# EAGLE design LVBarGraphDriver (EAGLE 7.5.0)
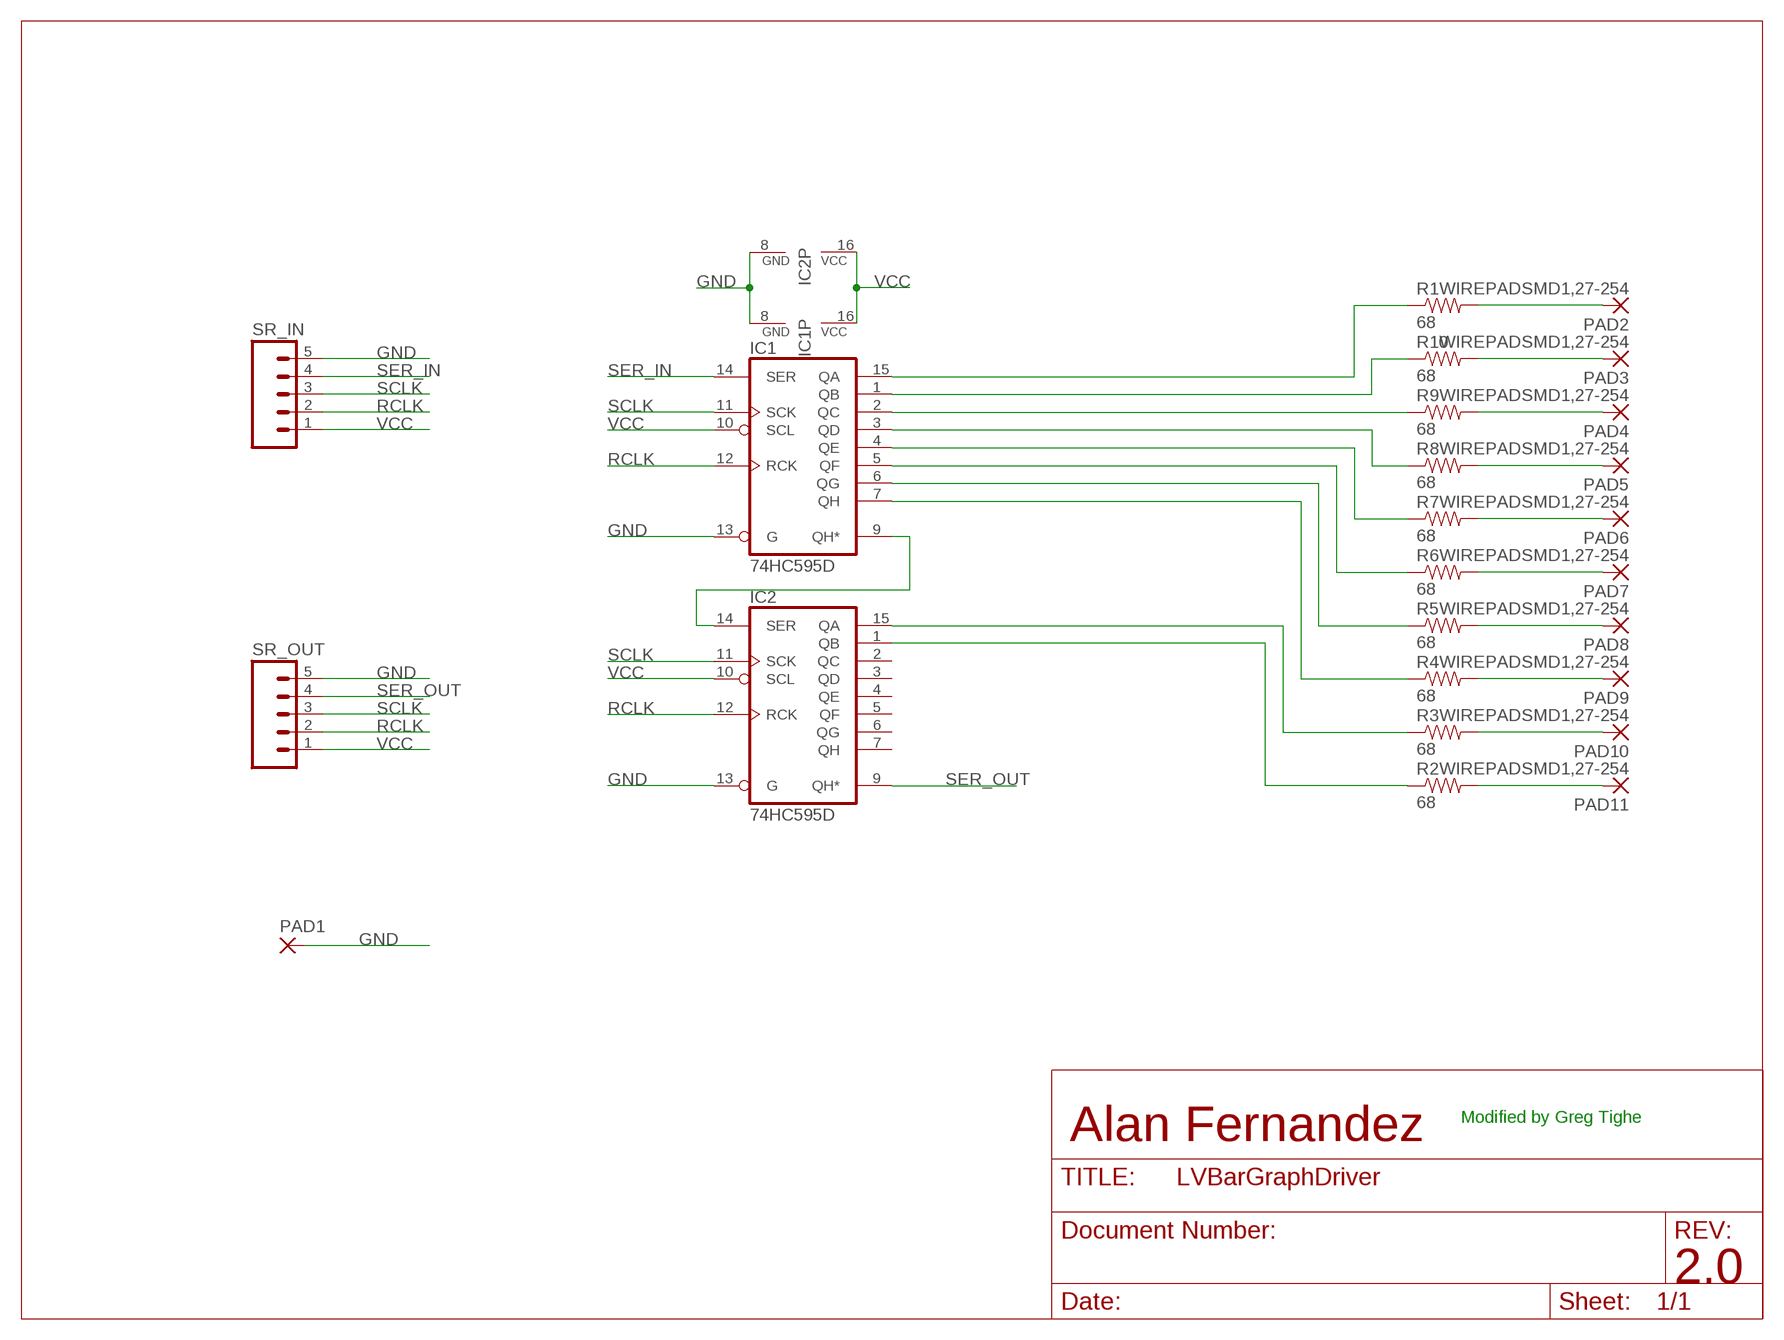
[diagram p0: schematic, sheet 1]

## Parts
IC1  74HC595D  [SO16]
IC2  74HC595D  [SO16]
PAD1  SMD2  [SMD1,27-2,54]
PAD2  WIREPADSMD1,27-254  [SMD1,27-2,54]
PAD3  WIREPADSMD1,27-254  [SMD1,27-2,54]
PAD4  WIREPADSMD1,27-254  [SMD1,27-2,54]
PAD5  WIREPADSMD1,27-254  [SMD1,27-2,54]
PAD6  WIREPADSMD1,27-254  [SMD1,27-2,54]
PAD7  WIREPADSMD1,27-254  [SMD1,27-2,54]
PAD8  WIREPADSMD1,27-254  [SMD1,27-2,54]
PAD9  WIREPADSMD1,27-254  [SMD1,27-2,54]
PAD10  WIREPADSMD1,27-254  [SMD1,27-2,54]
PAD11  WIREPADSMD1,27-254  [SMD1,27-2,54]
R1  68  RESISTOR1206  [1206]
R2  68  RESISTOR1206  [1206]
R3  68  RESISTOR1206  [1206]
R4  68  RESISTOR1206  [1206]
R5  68  RESISTOR1206  [1206]
R6  68  RESISTOR1206  [1206]
R7  68  RESISTOR1206  [1206]
R8  68  RESISTOR1206  [1206]
R9  68  RESISTOR1206  [1206]
R10  68  RESISTOR1206  [1206]
SR_IN  M05PTH  [1X05]
SR_OUT  M05PTH  [1X05]

## Nets
GND [GND]: IC1.8(GND) IC1.13(G) IC2.8(GND) IC2.13(G) PAD1.1(P) SR_IN.5 SR_OUT.5
N$1 [LED]: PAD11.1(P) R2.2
N$2 [LED]: PAD10.1(P) R3.2
N$3 [LED]: PAD9.1(P) R4.2
N$4 [LED]: PAD8.1(P) R5.2
N$5 [LED]: PAD7.1(P) R6.2
N$6 [LED]: PAD6.1(P) R7.2
N$7 [LED]: PAD5.1(P) R8.2
N$8 [LED]: PAD4.1(P) R9.2
N$9 [LED]: PAD3.1(P) R10.2
N$10 [LED]: PAD2.1(P) R1.2
N$11 [LED]: IC1.15(QA) R1.1
N$12 [LED]: IC1.1(QB) R10.1
N$13 [LED]: IC1.2(QC) R9.1
N$14 [LED]: IC1.3(QD) R8.1
N$15 [LED]: IC1.4(QE) R7.1
N$16 [LED]: IC1.5(QF) R6.1
N$17 [LED]: IC1.6(QG) R5.1
N$18 [LED]: IC1.7(QH) R4.1
N$19 [LED]: IC2.15(QA) R3.1
N$20 [LED]: IC2.1(QB) R2.1
N$22: IC1.9(QH*) IC2.14(SER)
RCLK: IC1.12(RCK) IC2.12(RCK) SR_IN.2 SR_OUT.2
SCLK: IC1.11(SCK) IC2.11(SCK) SR_IN.3 SR_OUT.3
SER_IN: IC1.14(SER) SR_IN.4
SER_OUT: IC2.9(QH*) SR_OUT.4
VCC [VCC]: IC1.10(SCL) IC1.16(VCC) IC2.10(SCL) IC2.16(VCC) SR_IN.1 SR_OUT.1
Unconnected: IC2.2(QC) IC2.3(QD) IC2.4(QE) IC2.5(QF) IC2.6(QG) IC2.7(QH)

## Notes on the sheet
- Modified by Greg Tighe
- Alan Fernandez
- 2.0

## Library data of the parts
IC1 IC2 = 74xx-eu:74*595: 8-bit SHIFT REGISTER, output latch
PAD1 = wirepad:SMD2: SMD PAD
PAD2-PAD11 = wirepad:WIREPAD: Wire PAD connect wire on PCB
R1-R10 = SparkFun-Resistors:RESISTOR: Resistor Basic schematic elements and footprints for 0603, 1206, and PTH resistors.
SR_IN SR_OUT = SparkFun-Connectors:M05: Header 5 Standard 5-pin 0.1" header. Use with straight break away headers (SKU : PRT-00116), right angle break away headers (PRT-00553), swiss pins (PRT-00743), machine pins (PRT-00117), and female headers (PRT-00115). Molex polarized connector foot print use with SKU : PRT-08230 with associated crimp pins and housings.

## Net classes
0 default: width 0.406 mm, drill 0.381 mm, clearance 0.305 mm
1 VCC: width 0.406 mm, drill 0.381 mm, clearance 0.305 mm
2 LED: width 0.406 mm, drill 0.381 mm, clearance 0.305 mm
3 GND: width 0.406 mm, drill 0.381 mm, clearance 0.305 mm

## Board
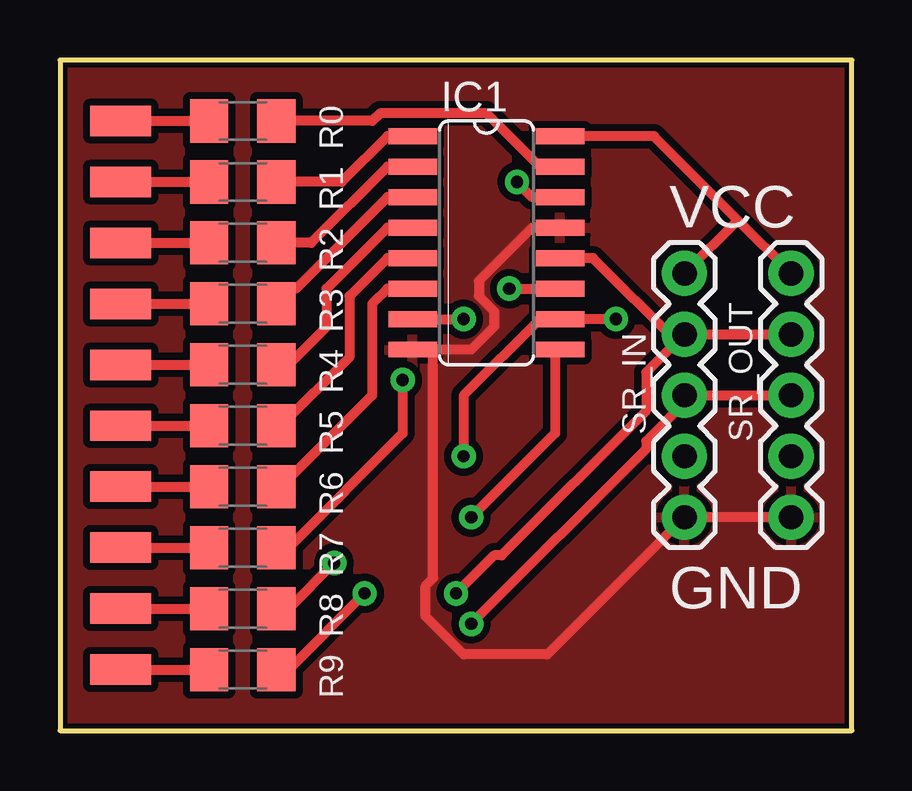
[diagram p1: board, top side]
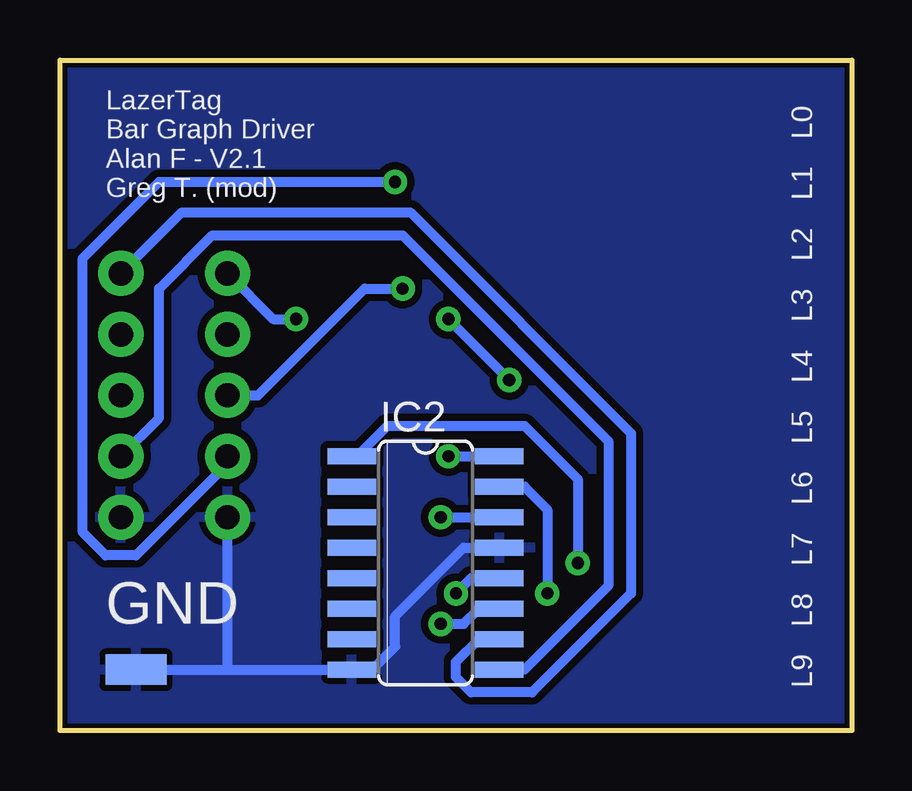
[diagram p2: board, bottom side, seen from below]

Size 33.02 x 27.94 mm. Coordinates in mm from the lower left corner, seen from the top.
Outline: 0,27.94 0,0 33.02,0 33.02,27.94 0,27.94
Copper layers (1*16): Top 0.035mm / dielectric 1.5mm / Bottom 0.035mm
Design rules "SparkFun-2-layer-STANDARD": minimum track width 10mil, minimum drill 20mil, track to track 10mil, track to pad 8mil, pad to pad 8mil, via to via 10mil, smd to smd 8mil, copper to edge 8mil, drill to drill 8mil, minimum pad ring 10mil, minimum via ring 10mil, stop-mask expansion 4mil, vias tented up to drill 25mil, thermal gap 10mil

### Footprints (pad centres in the part's own frame; a part is rotated, then mirrored left to right if it is on the bottom)
SO16 = smd 0.66 x 2.032: 1 -4.445,-3.073; 2 -3.175,-3.073; 3 -1.905,-3.073; 4 -0.635,-3.073; 5 0.635,-3.073; 6 1.905,-3.073; 7 3.175,-3.073; 8 4.445,-3.073; 9 4.445,3.073; 10 3.175,3.073; 11 1.905,3.073; 12 0.635,3.073; 13 -0.635,3.073; 14 -1.905,3.073; 15 -3.175,3.073; 16 -4.445,3.073
SMD1,27-2,54 = smd 1.27 x 2.54: 1 0,0
1206 = smd 1.6 x 1.8: 1 -1.4,0; 2 1.4,0
1X05 = drill 1.016 pad 1.88: 1 0,0; 2 2.54,0; 3 5.08,0; 4 7.62,0; 5 10.16,0

### Placement (x,y rotation side)
IC1  17.78,20.32 270 top
IC2  17.78,6.98 270 bottom
PAD1  29.84,2.54 90 bottom
PAD2  2.54,25.4 90 top
PAD3  2.54,22.86 90 top
PAD4  2.54,20.32 90 top
PAD5  2.54,17.78 90 top
PAD6  2.54,15.24 90 top
PAD7  2.54,12.7 90 top
PAD8  2.54,10.16 90 top
PAD9  2.54,7.62 90 top
PAD10  2.54,2.54 90 top
PAD11  2.54,5.08 90 top
R1  7.62,25.4 180 top
R2  7.62,5.08 180 top
R3  7.62,2.54 180 top
R4  7.62,7.62 180 top
R5  7.62,10.16 180 top
R6  7.62,12.7 180 top
R7  7.62,15.24 180 top
R8  7.62,17.78 180 top
R9  7.62,20.32 180 top
R10  7.62,22.86 180 top
SR_IN  26.03,19.05 270 top
SR_OUT  30.48,19.05 270 top

### Tracks (layer width: path | path; a pad name or v marks a point on that pad's centre or on a via)
GND
  Top 0.406: 15.56,15.88 17.14,15.88 18.1,16.83 18.1,17.46 17.46,18.1 17.46,18.73 19.68,20.95 IC1.13 | SR_OUT.5 SR_IN.5 20.32,3.18 16.83,3.18 15.24,4.76 15.24,6.03 15.56,6.35 15.56,15.88 | 15.56,15.88 IC1.8
  Bottom 0.406: PAD1.1 26.03,2.54 | 26.03,2.54 IC2.8 20,2.54 19.05,3.49 19.05,4.76 16.19,7.62 IC2.13 | 26.03,2.54 SR_IN.5
  pour Top: 0,27.94 33.02,27.94 33.02,0 0,0
  pour Bottom: 0,27.94 33.02,27.94 33.02,0 0,0
N$1
  Top 0.406: PAD11.1 R2.2
N$2
  Top 0.406: PAD10.1 R3.2
N$3
  Top 0.406: PAD9.1 R4.2
N$4
  Top 0.406: PAD8.1 R5.2
N$5
  Top 0.406: PAD7.1 R6.2
N$6
  Top 0.406: PAD6.1 R7.2
N$7
  Top 0.406: PAD5.1 R8.2
N$8
  Top 0.406: PAD4.1 R9.2
N$9
  Top 0.406: PAD3.1 R10.2
N$10
  Top 0.406: PAD2.1 R1.2
N$11
  Top 0.406: R1.1 13.02,25.4 13.33,25.72 17.78,25.72 20,23.49 IC1.15
N$12
  Top 0.406: IC1.1 13.65,24.77 11.75,22.86 9.53,22.86 R10.1
N$13
  Top 0.406: IC1.2 13.65,23.49 10.48,20.32 9.53,20.32 R9.1
N$14
  Top 0.406: R8.1 9.53,17.78 9.53,18.41 9.84,18.41 13.65,22.23 IC1.3
N$15
  Top 0.406: IC1.4 13.65,20.95 11.11,18.41 11.11,16.83 9.53,15.24 R7.1
N$16
  Top 0.406: 8.89,12.06 8.89,12.57 R6.1 9.21,12.7 12.06,15.56 12.06,18.1 13.65,19.69 IC1.5
N$17
  Top 0.406: IC1.6 13.65,18.41 13.02,17.78 13.02,13.97 9.21,10.16 R5.1
N$18  (via drill 0.51)
  Top 0.406: v14.29,14.61 14.29,12.38 9.53,7.62 R4.1 | IC1.7 v16.83,17.15
  Bottom 0.406: v16.83,17.15 v14.29,14.61
N$19  (via drill 0.51)
  Top 0.406: v12.7,5.71 9.53,2.54 R3.1
  Bottom 0.406: v12.7,5.71 12.7,9.21 13.65,10.16 IC2.15
N$20  (via drill 0.51)
  Top 0.406: v11.43,6.98 9.53,5.08 R2.1
  Bottom 0.406: v11.43,6.98 11.43,10.48 13.65,12.7 19.37,12.7 20.64,11.43 IC2.1
N$22  (via drill 0.51)
  Top 0.406: v17.14,8.89 20.64,12.38 20.64,15.88 IC1.9
  Bottom 0.406: v17.14,8.89 IC2.14
RCLK  (via drill 0.51)
  Top 0.406: v16.51,5.71 18.1,7.3 18.41,7.3 24.45,13.34 24.45,14.92 25.72,16.19 | IC1.12 22.23,19.69 25.72,16.19 | 25.72,16.19 SR_IN.2 SR_OUT.2
  Bottom 0.406: IC2.12 15.87,6.35 v16.51,5.71
SCLK  (via drill 0.51)
  Top 0.406: v17.14,4.45 24.45,11.75 24.45,12.06 26.03,13.65 SR_IN.3 SR_OUT.3 | v18.73,18.41 IC1.11
  Bottom 0.406: IC2.11 15.56,5.08 16.19,4.45 v17.14,4.45 | v18.73,18.41 20.32,18.41 24.77,13.97 SR_IN.3
SER_IN  (via drill 0.51)
  Top 0.406: IC1.14 19.68,22.23 v19.05,22.86
  Bottom 0.406: v19.05,22.86 28.89,22.86 32.07,19.69 32.07,8.25 31.11,7.3 29.84,7.3 26.03,11.11 SR_IN.4
SER_OUT
  Bottom 0.406: IC2.9 13.65,2.54 10.16,6.03 10.16,12.06 18.73,20.64 26.67,20.64 28.89,18.41 28.89,13.02 SR_OUT.4
VCC  (via drill 0.51)
  Top 0.406: v16.83,11.43 16.83,13.97 20,17.15 IC1.10 v23.18,17.15 | IC1.16 24.77,24.77 28.26,21.27 | SR_OUT.1 28.26,21.27 | 28.26,21.27 SR_IN.1
  Bottom 0.406: v16.83,11.43 IC2.16 | IC2.10 15.56,3.81 16.51,2.86 16.51,2.22 15.87,1.59 13.33,1.59 9.21,5.71 9.21,12.38 18.41,21.59 27.94,21.59 SR_OUT.1 | v23.18,17.15 24.13,17.15 SR_IN.1

### Text on the board
tPlace: R0 | R1 | R2 | R3 | R4 | R5 | R6 | R7 | R8 | R9
bPlace: L0 | L1 | LazerTag / Bar Graph Driver / Alan F - V2.1 / Greg T. (mod) | L2 | L3 | L4 | L5 | L6 | L7 | L8 | L9
tNames: VCC | GND
bNames: GND